# EAGLE design MYC_Homematic (EAGLE 7.3.0)
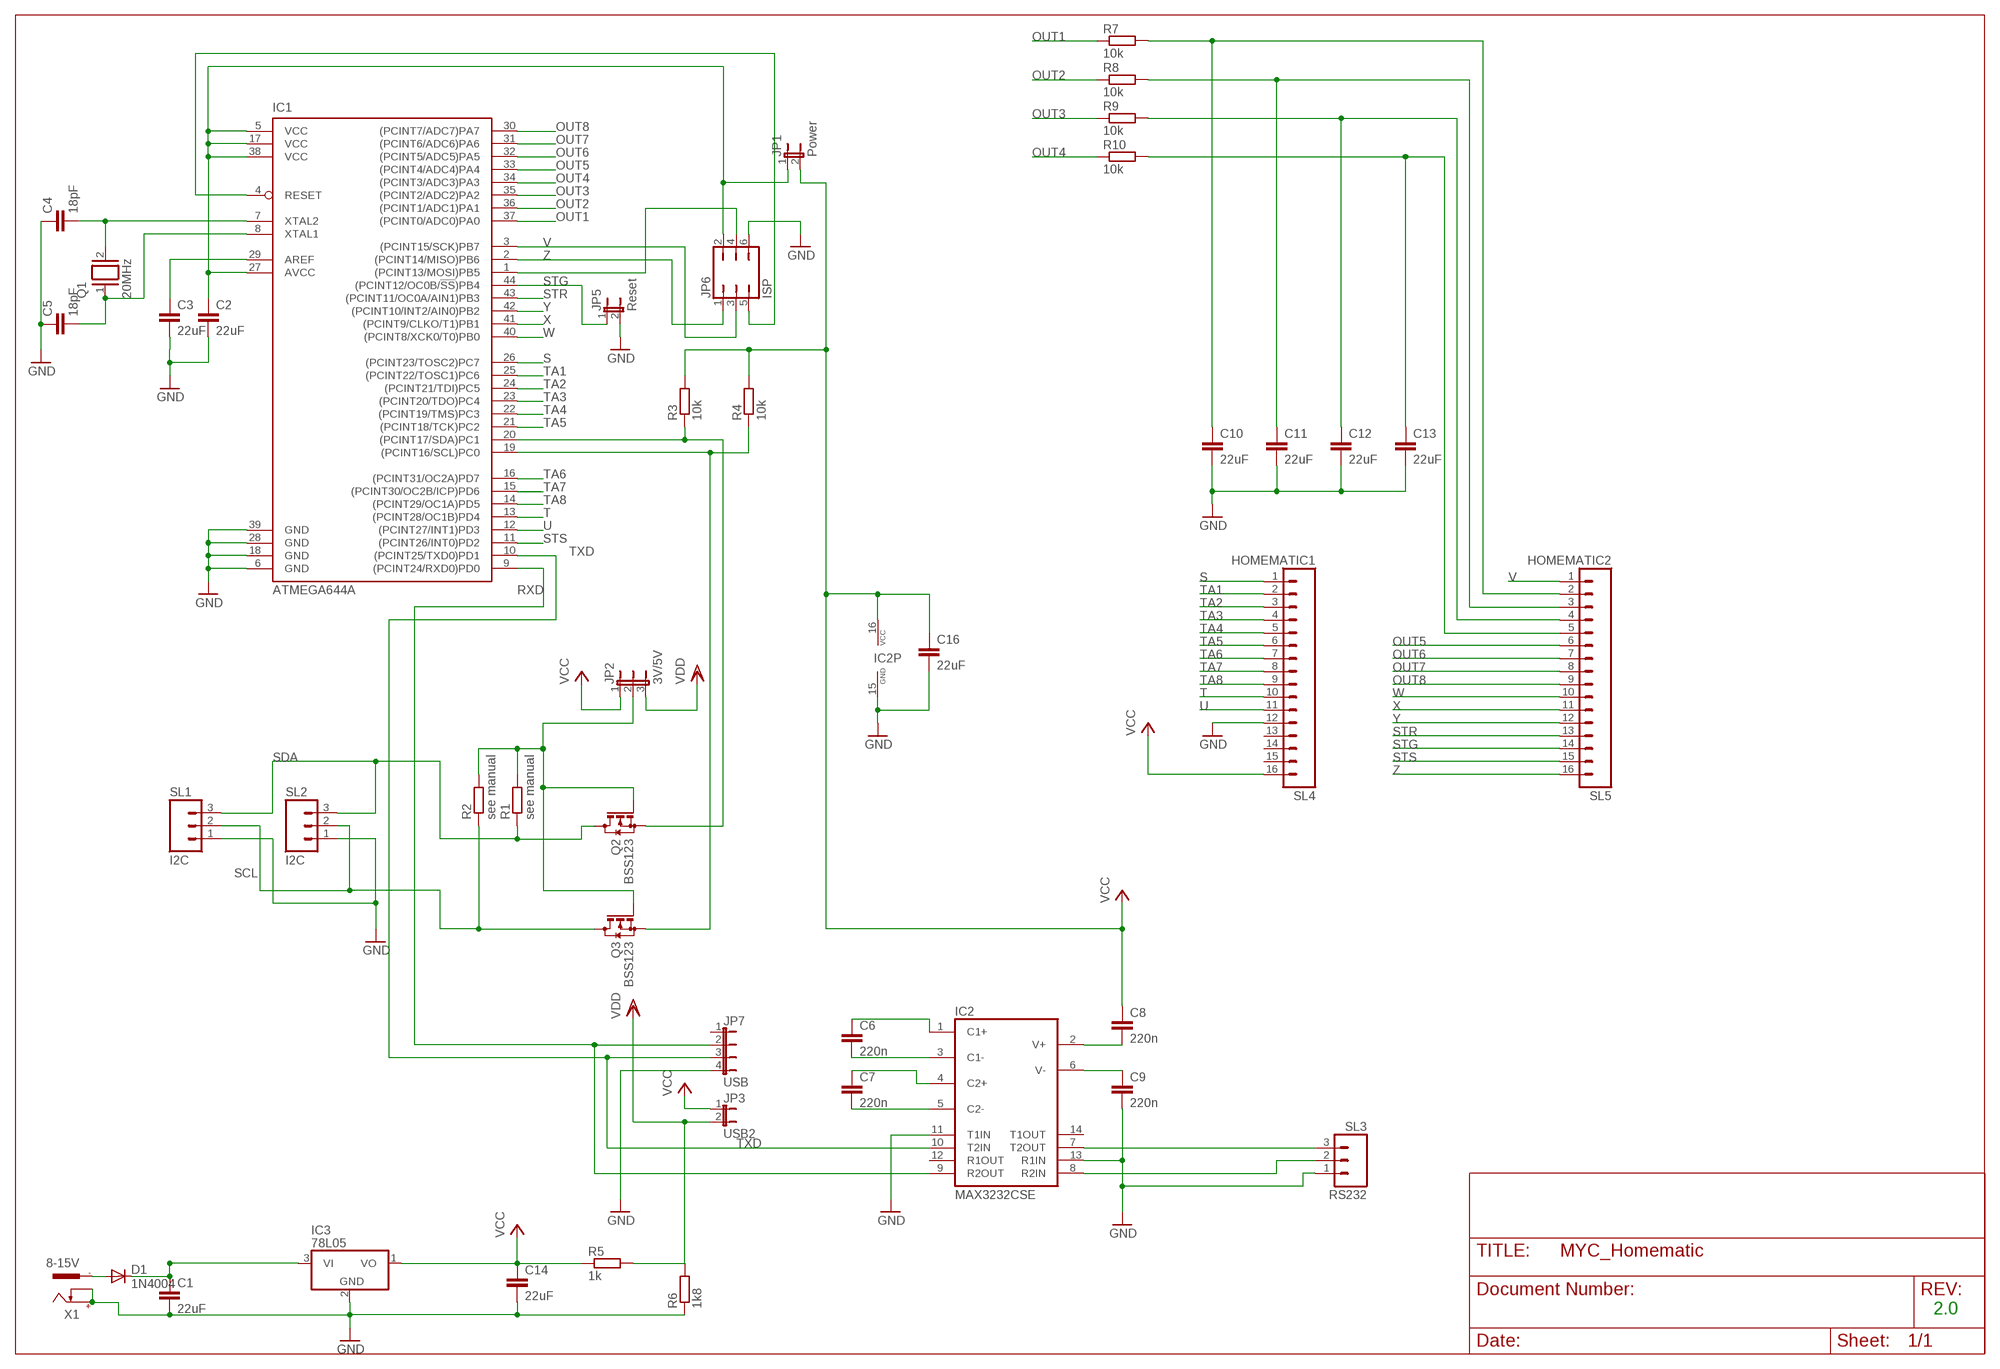
[diagram p0: schematic, sheet 1]

## Parts
C1  22uF  C-EUC1206  [C1206]
C2  22uF  C-EUC1206  [C1206]
C3  22uF  C-EUC1206  [C1206]
C4  18pF  C-EU025-030X050  [C025-030X050]
C5  18pF  C-EU025-030X050  [C025-030X050]
C6  220n  C-EUC1206  [C1206]
C7  220n  C-EUC1206  [C1206]
C8  220n  C-EUC1206  [C1206]
C9  220n  C-EUC1206  [C1206]
C10  22uF  C-EUC1206  [C1206]
C11  22uF  C-EUC1206  [C1206]
C12  22uF  C-EUC1206  [C1206]
C13  22uF  C-EUC1206  [C1206]
C14  22uF  C-EUC1206  [C1206]
C16  22uF  C-EUC1206  [C1206]
D1  1N4004  [DO41-10]
IC1  ATMEGA644A  [TQFP44]
IC2  MAX3232CSE  [SO16]
IC3  78L05  7805L  [TO92]
JP1  Power  JP1E  [JP1]
JP2  3V/5V  JP2E  [JP2]
JP3  USB2  JP1E  [JP1]
JP5  Reset  JP1E  [JP1]
JP6  ISP  JP3Q  [JP3Q]
JP7  USB  JP4E  [JP4]
Q1  20MHz  XTAL/S  [QS]
Q2  BSS123  [SOT23]
Q3  BSS123  [SOT23]
R1  see manual  R-EU_R1206  [R1206]
R2  see manual  R-EU_R1206  [R1206]
R3  10k  R-EU_R1206  [R1206]
R4  10k  R-EU_R1206  [R1206]
R5  1k  R-EU_R1206  [R1206]
R6  1k8  R-EU_R1206  [R1206]
R7  10k  R-EU_R1206  [R1206]
R8  10k  R-EU_R1206  [R1206]
R9  10k  R-EU_R1206  [R1206]
R10  10k  R-EU_R1206  [R1206]
SL1  I2C  M03  [03P]
SL2  I2C  M03  [03P]
SL3  RS232  M03  [03P]
SL4  HOMEMATIC1  M16  [16P]
SL5  HOMEMATIC2  M16  [16P]
X1  8-15V  737992-55  [737992-5]

## Nets
C13: C6.1 IC2.1(C1+)
GND: C1.2 C2.2 C3.2 C4.1 C5.1 C9.2 C10.2 C11.2 C12.2 C13.2 C14.2 C16.2 IC1.6(GND) IC1.18(GND) IC1.28(GND) IC1.39(GND) IC2.11(T1IN) IC2.13(R1IN) IC2.15(GND) IC3.2(GND) JP5.2 JP6.6 JP7.4 R6.1 SL1.1 SL2.1 SL3.1 SL4.12 X1.+ X1.K
N$1: C1.1 D1.C IC3.3(VI)
N$3: C7.2 IC2.5(C2-)
N$4: JP2.2 Q2.1(G) Q3.1(G) R1.2 R2.2
N$5: IC1.19((PCINT16/SCL)PC0) Q3.2(S) R4.1
N$6: C3.1 IC1.29(AREF)
N$7: C2.1 IC1.5(VCC) IC1.17(VCC) IC1.27(AVCC) IC1.38(VCC) JP1.1 JP6.2
N$8: IC1.20((PCINT17/SDA)PC1) Q2.2(S) R3.1
N$10: D1.A X1.-1
N$11: IC2.8(R2IN) SL3.2
N$12: IC1.1((PCINT13/MOSI)PB5) JP6.4
N$13: C7.1 IC2.4(C2+)
N$14: C6.2 IC2.3(C1-)
N$15: C10.1 R7.2 SL5.2
N$16: C8.2 IC2.2(V+)
N$17: C9.1 IC2.6(V-)
N$19: C4.2 IC1.7(XTAL2) Q1.2
N$20: C11.1 R8.2 SL5.3
N$21: C12.1 R9.2 SL5.4
N$22: C13.1 R10.2 SL5.5
N$24: IC1.4(RESET) JP6.5
N$27: IC2.7(T2OUT) SL3.3
N$37: C5.2 IC1.8(XTAL1) Q1.1
OUT1: IC1.37((PCINT0/ADC0)PA0) R7.1
OUT2: IC1.36((PCINT1/ADC1)PA1) R8.1
OUT3: IC1.35((PCINT2/ADC2)PA2) R9.1
OUT4: IC1.34((PCINT3/ADC3)PA3) R10.1
OUT5: IC1.33((PCINT4/ADC4)PA4) SL5.6
OUT6: IC1.32((PCINT5/ADC5)PA5) SL5.7
OUT7: IC1.31((PCINT6/ADC6)PA6) SL5.8
OUT8: IC1.30((PCINT7/ADC7)PA7) SL5.9
RXD: IC1.9((PCINT24/RXD0)PD0) IC2.9(R2OUT) JP7.2
S: IC1.26((PCINT23/TOSC2)PC7) SL4.1
SCL: Q3.3(D) R2.1 SL1.2 SL2.2
SDA: Q2.3(D) R1.1 SL1.3 SL2.3
STG: IC1.44((PCINT12/OC0B/!SS!)PB4) JP5.1 SL5.14
STR: IC1.43((PCINT11/OC0A/AIN1)PB3) SL5.13
STS: IC1.11((PCINT26/INT0)PD2) SL5.15
T: IC1.13((PCINT28/OC1B)PD4) SL4.10
TA1: IC1.25((PCINT22/TOSC1)PC6) SL4.2
TA2: IC1.24((PCINT21/TDI)PC5) SL4.3
TA3: IC1.23((PCINT20/TDO)PC4) SL4.4
TA4: IC1.22((PCINT19/TMS)PC3) SL4.5
TA5: IC1.21((PCINT18/TCK)PC2) SL4.6
TA6: IC1.16((PCINT31/OC2A)PD7) SL4.7
TA7: IC1.15((PCINT30/OC2B/ICP)PD6) SL4.8
TA8: IC1.14((PCINT29/OC1A)PD5) SL4.9
TXD: IC1.10((PCINT25/TXD0)PD1) IC2.10(T2IN) JP7.3
U: IC1.12((PCINT27/INT1)PD3) SL4.11
V: IC1.3((PCINT15/SCK)PB7) JP6.3 SL5.1
VCC: C8.1 C14.1 C16.1 IC2.16(VCC) IC3.1(VO) JP1.2 JP2.1 JP3.1 R3.2 R4.2 R5.1 SL4.16
VDD: JP2.3 JP3.2 R5.2 R6.2
W: IC1.40((PCINT8/XCK0/T0)PB0) SL5.10
X: IC1.41((PCINT9/CLKO/T1)PB1) SL5.11
Y: IC1.42((PCINT10/INT2/AIN0)PB2) SL5.12
Z: IC1.2((PCINT14/MISO)PB6) JP6.1 SL5.16
Unconnected: IC2.12(R1OUT) IC2.14(T1OUT) JP7.1 SL4.13 SL4.14 SL4.15 X1.-2

## Notes on the sheet
- 2.0

## Library data of the parts
C1-C14 C16 = resistor:C-EU: CAPACITOR, European symbol
D1 = diode:1N4004: DIODE general purpose rectifier, 1 A
IC1 = atmel:ATMEGA644: 8-bit Microcontroller with 64K Bytes In-System Programmable Flash Source: http://www.atmel.com/dyn/resources/prod_documents/doc2593.pdf; MPN: ATMEGA644PV-10AU; OC_FARNELL: 1455123; OC_NEWARK: 58M3748
IC2 = maxim:MAX3232*: True RS-232 Transceivers 3.0V to 5.5V, Low-Power up to 1Mbps, Using Four 0.1µF External Capacitors Source: http://pdfserv.maxim-ic.com/en/ds/MAX3222-MAX3241.pdf; MPN: MAX3232CSE; OC_FARNELL: 9725490; OC_NEWARK: 90C2890
IC3 = linear:78*: Positive VOLTAGE REGULATOR Source: http://cache.national.com/ds/LM/LM78L05.pdf http://www.fairchildsemi.com/ds/LM/LM7805.pdf
JP1 JP3 JP5 = jumper:JP1E: JUMPER
JP2 = jumper:JP2E: JUMPER
JP6 = jumper:JP3Q: JUMPER
JP7 = jumper:JP4E: JUMPER
Q1 = special:XTAL/S: CRYSTAL
Q2 Q3 = transistor-small-signal:BSS123: N-CHANNEL MOS FET
R1-R10 = resistor:R-EU_: RESISTOR, European symbol
SL1-SL3 = con-amp-quick:M03: AMP QUICK CONNECTOR; OC_FARNELL: unknown; OC_NEWARK: unknown
SL4 SL5 = con-amp-quick:M16: AMP QUICK CONNECTOR; OC_FARNELL: unknown; OC_NEWARK: unknown
X1 = con-conrad:737992-55: FEMALE PRINT CONNECTOR DIN 45323 (34V/3A), ROKA, distributor Conrad

## Board
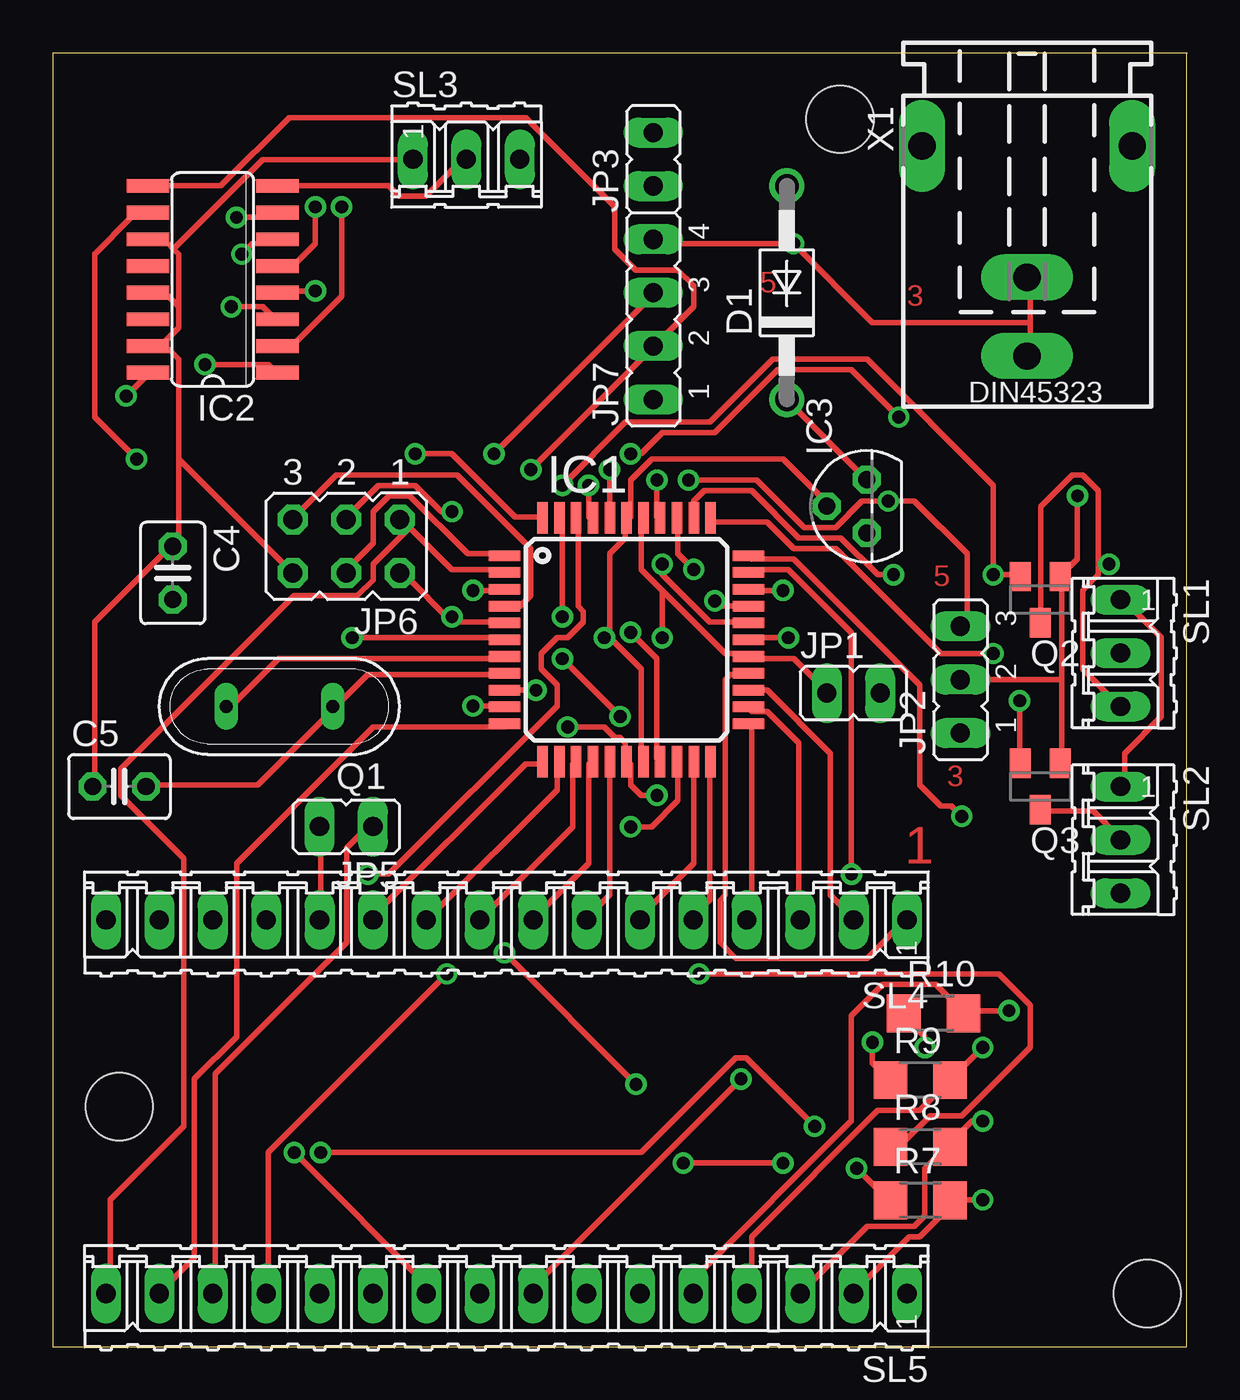
[diagram p1: board, top side]
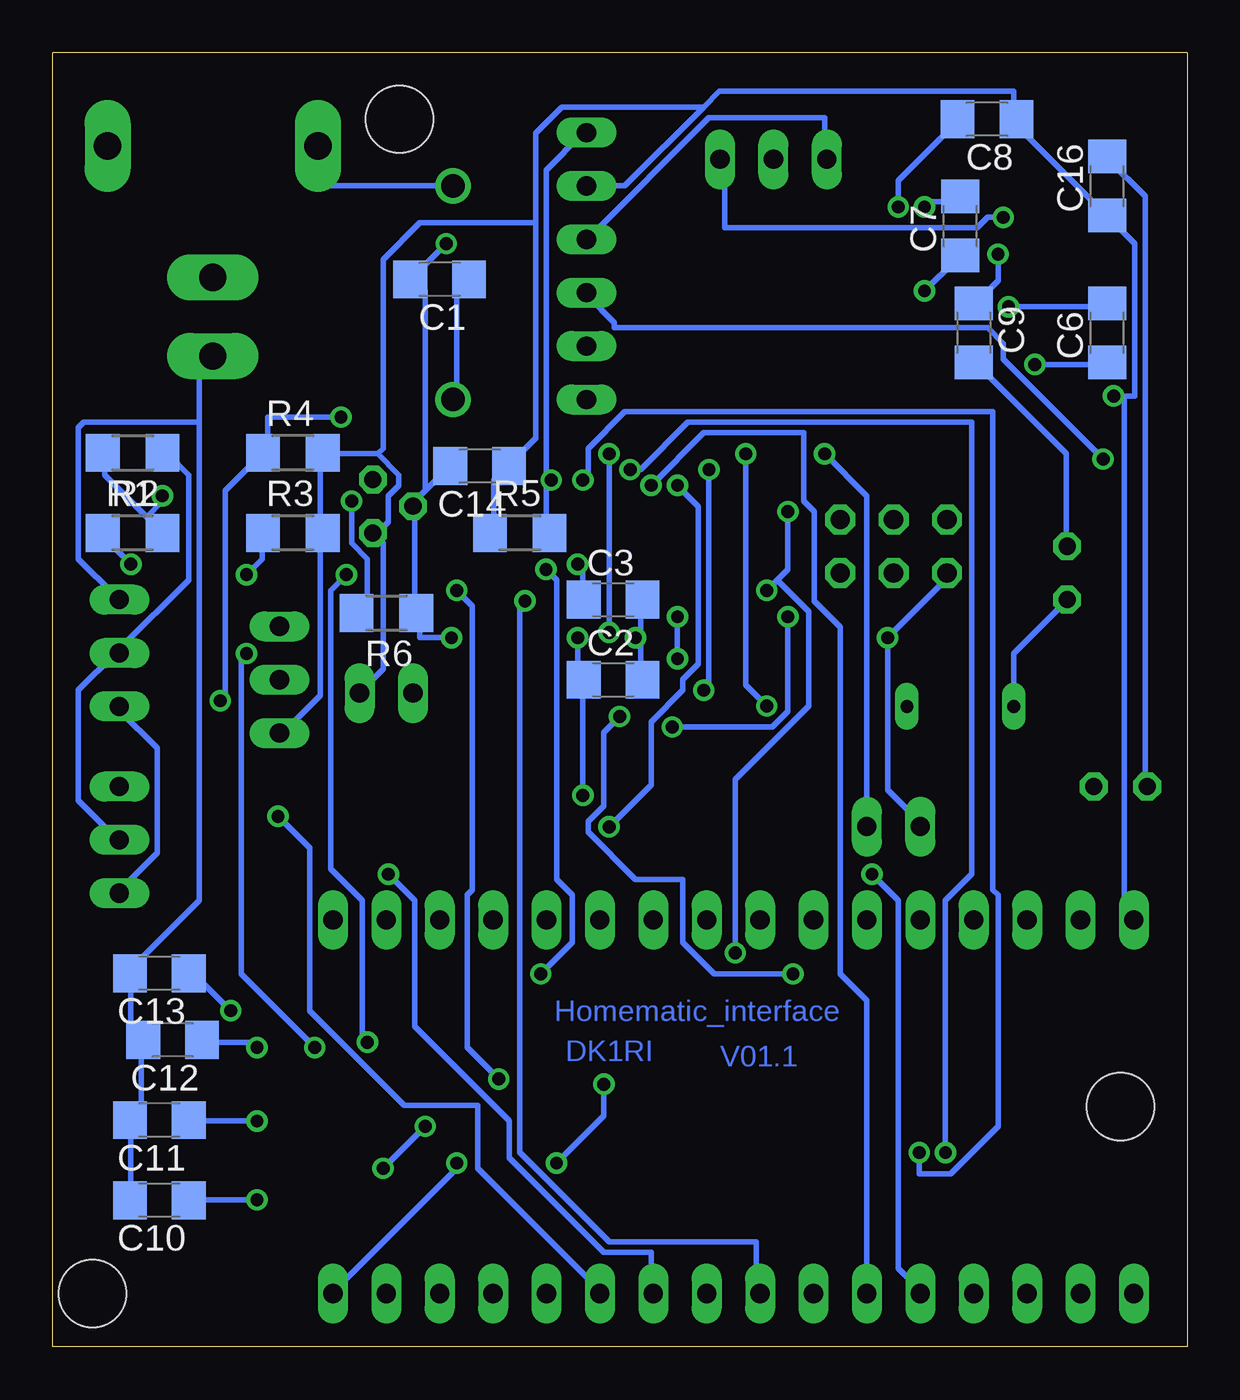
[diagram p2: board, bottom side, seen from below]

Size 53.98 x 61.59 mm. Coordinates in mm from the lower left corner, seen from the top.
Outline: 53.95,61.58 53.95,0 0,0 0,61.59 53.98,61.59
Copper layers (1*16): Top 0.035mm / dielectric 1.5mm / Bottom 0.035mm
Design rules "default": minimum track width 10mil, minimum drill 24mil, track to track 8mil, track to pad 8mil, pad to pad 8mil, via to via 8mil, smd to smd 8mil, copper to edge 40mil, drill to drill 8mil, minimum pad ring 10mil, minimum via ring 8mil, stop-mask expansion 4mil, vias tented up to drill 0mil, thermal gap 10mil
Holes 3.2 mm at 37.47,58.42 52.07,2.54 3.17,11.43

### Footprints (pad centres in the part's own frame; a part is rotated, then mirrored left to right if it is on the bottom)
C1206 = smd 1.6 x 1.8: 1 -1.4,0; 2 1.4,0
C025-030X050 = drill 0.813 octagon: 1 -1.27,0; 2 1.27,0
DO41-10 = drill 1.118: A 5.08,0; C -5.08,0
TQFP44 = smd 1.5 x 0.5: 1 -5.8,4; 2 -5.8,3.2; 3 -5.8,2.4; 4 -5.8,1.6; 5 -5.8,0.8; 6 -5.8,0; 7 -5.8,-0.8; 8 -5.8,-1.6; 9 -5.8,-2.4; 10 -5.8,-3.2; 11 -5.8,-4; 23 5.8,-4; 24 5.8,-3.2; 25 5.8,-2.4; 26 5.8,-1.6; 27 5.8,-0.8; 28 5.8,0; 29 5.8,0.8; 30 5.8,1.6; 31 5.8,2.4; 32 5.8,3.2; 33 5.8,4 | smd 0.5 x 1.5: 12 -4,-5.8; 13 -3.2,-5.8; 14 -2.4,-5.8; 15 -1.6,-5.8; 16 -0.8,-5.8; 17 0,-5.8; 18 0.8,-5.8; 19 1.6,-5.8; 20 2.4,-5.8; 21 3.2,-5.8; 22 4,-5.8; 34 4,5.8; 35 3.2,5.8; 36 2.4,5.8; 37 1.6,5.8; 38 0.8,5.8; 39 0,5.8; 40 -0.8,5.8; 41 -1.6,5.8; 42 -2.4,5.8; 43 -3.2,5.8; 44 -4,5.8
SO16 = smd 0.66 x 2.032: 1 -4.445,-3.073; 2 -3.175,-3.073; 3 -1.905,-3.073; 4 -0.635,-3.073; 5 0.635,-3.073; 6 1.905,-3.073; 7 3.175,-3.073; 8 4.445,-3.073; 9 4.445,3.073; 10 3.175,3.073; 11 1.905,3.073; 12 0.635,3.073; 13 -0.635,3.073; 14 -1.905,3.073; 15 -3.175,3.073; 16 -4.445,3.073
TO92 = drill 0.813 octagon: 1 -1.27,0; 2 0,1.905; 3 1.27,0
JP1 = drill 0.914 long: 1 0,-1.27; 2 0,1.27
JP2 = drill 0.914 long: 1 -2.54,0; 2 0,0; 3 2.54,0
JP3Q = drill 0.914 octagon: 1 -2.54,-1.27; 2 -2.54,1.27; 3 0,-1.27; 4 0,1.27; 5 2.54,-1.27; 6 2.54,1.27
JP4 = drill 0.914 long: 1 -3.81,0; 2 -1.27,0; 3 1.27,0; 4 3.81,0
QS = drill 0.61 long: 1 -2.54,0; 2 2.54,0
SOT23 = smd 1 x 1.4: 1 -0.95,-1.1; 2 0.95,-1.1; 3 0,1.1
R1206 = smd 1.6 x 1.803: 1 -1.422,0; 2 1.422,0
03P = drill 0.914 long: 1 -2.54,0; 2 0,0; 3 2.54,0
16P = drill 0.914 long: 1 -19.05,0; 2 -16.51,0; 3 -13.97,0; 4 -11.43,0; 5 -8.89,0; 6 -6.35,0; 7 -3.81,0; 8 -1.27,0; 9 1.27,0; 10 3.81,0; 11 6.35,0; 12 8.89,0; 13 11.43,0; 14 13.97,0; 15 16.51,0; 16 19.05,0
737992-5 = drill 1.3 pad 2.184 long: + 0,10; -1 5,0; -2 -5,0; K 0,6.25

### Placement (x,y rotation side)
C1  35.56,50.8 180 bottom
C2  27.3,31.75 0 bottom
C3  27.3,35.56 0 bottom
C4  5.71,36.83 270 top
C5  3.17,26.67 0 top
C6  3.81,48.26 90 bottom
C7  10.79,53.34 90 bottom
C8  9.53,58.42 180 bottom
C9  10.16,48.26 270 bottom
C10  48.9,6.99 180 bottom
C11  48.9,10.79 180 bottom
C12  48.26,14.61 180 bottom
C13  48.9,17.78 180 bottom
C14  33.66,41.91 180 bottom
C16  3.81,55.24 90 bottom
D1  34.92,50.16 90 top
IC1  27.3,33.66 0 top
IC2  7.62,50.8 90 top
IC3  38.73,40.01 90 top
JP1  38.1,31.11 270 top
JP2  43.18,31.75 90 top
JP3  28.57,56.52 0 top
JP5  13.97,24.77 90 top
JP6  13.97,38.1 180 top
JP7  28.57,48.9 90 top
Q1  10.79,30.48 180 top
Q2  46.99,35.56 180 top
Q3  46.99,26.67 180 top
R1  50.16,38.73 0 bottom
R2  50.16,42.55 180 bottom
R3  42.55,38.73 0 bottom
R4  42.55,42.55 0 bottom
R5  31.75,38.73 0 bottom
R6  38.1,34.92 180 bottom
R7  41.27,6.99 0 top
R8  41.27,9.53 0 top
R9  41.27,12.7 0 top
R10  41.91,15.88 0 top
SL1  50.8,33.02 270 top
SL2  50.8,24.13 270 top
SL3  19.68,56.52 0 top
SL4  21.59,20.32 180 top
SL5  21.59,2.54 180 top
X1  46.35,57.15 180 top

### Tracks (layer width: path | path; a pad name or v marks a point on that pad's centre or on a via)
C13  (via drill 0.61)
  Top 0.254: v7.25,46.75 10.25,46.75 10.5,46.5 IC2.1
  Bottom 0.254: v7.25,46.75 4,46.75 C6.1
GND  (via drill 0.61)
  Top 0.254: SL2.1 51,26.75 51,28.25 52.75,30 52.75,33.75 51,35.5 SL1.1 | 46.5,48.75 46.5,50.75 X1.K | 46.5,48.75 46.5,47.25 X1.+ | 26.5,33.75 28,32.25 28,28 IC1.18 | 26.5,33.75 26.5,37.75 27.25,38.5 27.25,39.25 IC1.39 27.5,39.5 27.5,41.25 28.5,42.25 34.75,42.25 36.75,40.25 IC3.2 | 26.5,33.75 v26.25,33.75 | v35,33.75 33.25,33.75 IC1.28 | SL4.12 12.75,20.5 12.75,24.75 JP5.2 | v14.25,33.75 21.5,33.75 IC1.6 | 5.25,47.75 4.75,47.75 IC2.15 5.25,47.75 | 5.25,47.75 6,48.5 6,49.5 | 6,49.5 5.5,50 4.75,50 IC2.13 | 5.75,52.25 6,52 6,49.5 | 5.75,52.25 5.5,52.5 4.75,52.5 IC2.11 | 5.25,47.75 6,47 6,42.25 | 6,42.25 6,38.5 5.75,38.25 C4.1 5.5,38 2,34.5 2,26.75 C5.1 | 5.75,52.25 10,56.5 17,56.5 SL3.1 | 6,42.25 11.25,37 JP6.6 | JP7.4 28.75,52.5 v35.25,52.5 39,48.75 46.5,48.75
  Bottom 0.254: C10.2 50.25,7 50.25,10.75 C11.2 50.25,11 49.75,11.5 49.75,14.5 C12.2 49.75,14.75 50.25,15.25 50.25,17.75 C13.2 50.25,18 47,21.25 47,44 | 47,44 47,46.5 46.5,47 X1.+ | 47,44 52.5,44 52.75,43.75 52.75,37.5 51,35.75 SL1.1 | 26,33.75 26,35.5 C3.2 | 26,33.75 26,31.75 C2.2 | v26.25,33.75 26,33.75 | v35,33.75 36.5,33.75 36.5,34.75 R6.1 36.75,35 36.75,40 IC3.2 36.75,40.25 36.25,40.75 | 36.25,40.75 35.25,41.75 C14.2 | 36.25,40.75 36.25,50.25 36.75,50.75 C1.2 36.75,51 v35.25,52.5 | C16.2 3.75,56.5 2,54.75 2,26.75 C5.1 | JP6.6 11.5,36.75 11.5,36.5 v14.25,33.75 14.25,26.5 12.75,25 JP5.2 | JP7.4 28.5,52.75 22.75,58.5 17.25,58.5 17.25,56.75 SL3.1 | C9.2 10,46.75 5.75,42.5 5.75,38.25 C4.1
N$1
  Top 0.254: IC3.3 38.5,41.5 35,45 D1.C
  Bottom 0.254: C1.1 34.25,50.75 34.75,50.25 34.75,45.25 D1.C
N$3  (via drill 0.61)
  Top 0.254: v12.5,54.25 12.5,52.5 11.5,51.5 10.75,51.5 IC2.5
  Bottom 0.254: v12.5,54.25 12.5,54.5 11,54.5 C7.2
N$4  (via drill 0.61)
  Top 0.254: 48,31.75 48,36.5 Q2.1 48,36.75 48.75,37.5 v48.75,40.5 | 48,31.75 48,28 Q3.1 | 48,31.75 JP2.2
  Bottom 0.254: 49.5,39.5 51.5,41.5 51.5,42.5 R2.2 | 49.5,39.5 48.75,38.75 R1.2 49.5,39.5 | 49.5,39.5 48.75,40.25 v48.75,40.5
N$5  (via drill 0.61)
  Top 0.254: v46,30.75 46,28 Q3.2 | v27.5,34 28.75,32.75 28.75,28 IC1.19 | v27.5,42.5 28,42.5 29,43.5 31.5,43.5 34.5,46.5 38,46.5 v40.25,44.25
  Bottom 0.254: v46,30.75 45.75,31 45.75,40.75 44,42.5 R4.1 43.75,42.75 43.75,44.25 v40.25,44.25 | v27.5,42.5 v27.5,34
N$6  (via drill 0.61)
  Top 0.254: v29,37.25 29,36.75 31.25,34.5 33,34.5 IC1.29
  Bottom 0.254: v29,37.25 28.75,37 28.75,35.75 C3.1
N$7  (via drill 0.61)
  Top 0.254: 19,34.5 21.5,34.5 IC1.5 | 19,34.5 16.75,36.75 JP6.2 | v28.75,26.25 28,26.25 27.5,26.75 27.5,27.75 IC1.17 27.25,28 27.25,28.75 27,29 26.75,29 26.25,29.5 v24.5,29.5 | JP1.1 36.75,31.25 35.25,32.75 33.25,32.75 IC1.27 33,33 32,33 29,36 | 29,36 28,37 28,39.25 IC1.38 | 29,36 v29,33.75 | v19,34.75 19,34.5
  Bottom 0.254: 28.75,31.75 v28.75,26.25 | 28.75,31.75 29,32 v29,33.75 | 28.75,31.75 C2.1 | v19,34.75 19,30.25 19.75,29.5 v24.5,29.5
N$8  (via drill 0.61)
  Top 0.254: Q2.2 46,36.75 v44.75,36.75 44.75,41 38.75,47 34.25,47 31.25,44 27.25,44 v24.25,41 | v27.5,24.75 28.5,24.75 29.75,26 29.75,27.75 IC1.20
  Bottom 0.254: v44.75,36.75 44,37.5 44,38.5 R3.1 | v27.5,24.75 25.5,26.75 25.5,29.75 24,31.25 24,31.75 23.25,32.5 23.25,40 v24.25,41
N$10
  Bottom 0.254: D1.A 35,55.25 41.25,55.25 41.25,57 X1.-1
N$11
  Top 0.254: IC2.8 10.75,55.25 16,55.25 16.5,54.75 17.75,54.75 19.5,56.5 SL3.2
N$12
  Top 0.254: IC1.1 21.5,37.75 19.75,37.75 17,40.5 16,40.5 15.25,39.75 15.25,38.25 14,37 JP6.4
N$13  (via drill 0.61)
  Top 0.254: v12.5,50.25 10.75,50.25 IC2.4
  Bottom 0.254: v12.5,50.25 11,51.75 C7.1
N$14  (via drill 0.61)
  Top 0.254: v8.5,49.5 10,49.5 10.5,49 IC2.3
  Bottom 0.254: v8.5,49.5 4,49.5 C6.2
N$15  (via drill 0.61)
  Top 0.254: v44.25,7 42.75,7 R7.2 42.75,6.75 41.25,5.25 40.75,5.25 38.25,2.75 SL5.2
  Bottom 0.254: v44.25,7 47.25,7 C10.1
N$16  (via drill 0.61)
  Top 0.254: v13.75,54.25 13.75,50 11.5,47.75 10.75,47.75 IC2.2
  Bottom 0.254: v13.75,54.25 13.75,55.5 11,58.25 C8.2
N$17  (via drill 0.61)
  Top 0.254: v9,52 9.5,52.5 10.5,52.5 IC2.6
  Bottom 0.254: v9,52 9,50.75 10,49.75 C9.1
N$19
  Top 0.254: IC1.7 21.5,32.75 10.75,32.75 8.5,30.5 Q1.2
  Bottom 0.254: C4.2 5.75,35.5 8.25,33 8.25,30.5 Q1.2
N$20  (via drill 0.61)
  Top 0.254: v44.25,10.75 43.75,10.75 42.75,9.75 R8.2 42.5,9.5 41.5,8.5 41.5,6.25 41,5.75 38.75,5.75 35.75,2.75 SL5.3
  Bottom 0.254: v44.25,10.75 47.25,10.75 C11.1
N$21  (via drill 0.61)
  Top 0.254: v44.25,14.25 42.75,12.75 R9.2 42.5,12.5 41.25,11.25 39.25,11.25 33.25,5.25 33.25,2.75 SL5.4
  Bottom 0.254: v44.25,14.25 44.25,14.5 46.75,14.5 C12.1
N$22  (via drill 0.61)
  Top 0.254: v45.5,16 43.5,16 R10.2 43.25,16 42,17.25 39.5,17.25 38,15.75 38,10.75 30.5,3.25 30.5,2.75 SL5.5
  Bottom 0.254: v45.5,16 47.25,17.75 C13.1
N$24
  Top 0.254: IC1.4 21.75,35.25 22.25,35.25 22.75,35.75 22.75,38 19.25,41.5 13.5,41.5 11.5,39.5 JP6.5
N$27  (via drill 0.61)
  Top 0.254: v8.75,53.75 10.5,53.75 IC2.7
  Bottom 0.254: v8.75,53.75 9.5,53.75 10,53.25 22,53.25 22,56.5 SL3.3
N$37
  Top 0.254: IC1.8 21.5,32 15,32 13.5,30.5 Q1.1 13.25,30.25 9.75,26.75 4.5,26.75 C5.2
OUT1  (via drill 0.61)
  Top 0.254: v28.75,41.25 28.75,39.5 IC1.37 | v12.75,9.25 28,9.25 32.5,13.75 33,13.75 v36.25,10.5 | v38.25,8.5 39.75,7 R7.1
  Bottom 0.254: v28.75,41.25 28.5,41.5 28.5,42.75 26.75,44.5 9.25,44.5 9.25,21.75 9,21.5 9,10.5 11.25,8.25 12.75,8.25 v12.75,9.25 | v38.25,8.5 v36.25,10.5
OUT2  (via drill 0.61)
  Top 0.254: v30.5,37 29.75,37.75 29.75,39.25 IC1.36 | v30.75,17.75 45,17.75 46.5,16.25 46.5,14.25 43.25,11 41.75,11 40.5,9.75 40,9.75 R8.1
  Bottom 0.254: v30.5,37 30,36.5 30,22.25 29.25,21.5 29.25,19.25 v30.75,17.75
OUT3  (via drill 0.61)
  Top 0.254: v40,36.75 39.25,36.75 37.5,38.5 35.5,38.5 33.25,40.75 31,40.75 30.5,40.25 30.5,39.5 IC1.35 | v39,14.5 39,13.5 39.75,12.75 R9.1
  Bottom 0.254: v40,36.75 40.75,36 40.75,22.75 39.25,21.25 39.25,14.75 v39,14.5
OUT4  (via drill 0.61)
  Top 0.254: v44.75,33 42.25,33 37.25,38 35.25,38 34,39.25 31.5,39.25 IC1.34 | v41.5,14.25 41.5,14.75 40.5,15.75 R10.1
  Bottom 0.254: v44.75,33 45,32.75 45,17.75 v41.5,14.25
OUT5  (via drill 0.61)
  Top 0.254: v43.25,25.25 42.75,25.75 42.25,25.75 41.25,26.75 41.25,31.5 35.25,37.5 33.25,37.5 IC1.33
  Bottom 0.254: v43.25,25.25 41.75,23.75 41.75,16 37.25,11.5 33.75,11.5 33.75,8.5 28,2.75 SL5.6
OUT6  (via drill 0.61)
  Top 0.254: v38,22.5 38,34 35,37 33.25,37 IC1.32
  Bottom 0.254: v38,22.5 36.75,21.25 36.75,15.25 32.25,10.75 32.25,9 27.75,4.5 25.5,4.5 25.5,2.75 SL5.7
OUT7  (via drill 0.61)
  Top 0.254: v34.75,36 33.25,36 IC1.31 | v32.75,12.75 22.75,2.75 SL5.8
  Bottom 0.254: v34.75,36 34,35.25 34,21.75 34.25,21.5 34.25,14.25 v32.75,12.75
OUT8  (via drill 0.61)
  Top 0.254: v31.5,35.5 31.75,35.25 33,35.25 IC1.30
  Bottom 0.254: v31.5,35.5 31.75,35.25 31.75,9.25 27.5,5 20.5,5 20.5,2.75 SL5.9
RXD  (via drill 0.61)
  Top 0.254: v23,31.25 21.75,31.25 IC1.9 | v22.75,41.75 28.5,47.5 JP7.2 28.75,47.75 30.5,49.5 30.5,50.5 29.75,51.25 27.75,51.25 26.75,52.25 26.75,54.25 22.5,58.5 11.25,58.5 8,55.25 4.75,55.25 IC2.9
  Bottom 0.254: v23,31.25 22.75,31.5 v22.75,41.75
S
  Top 0.254: IC1.26 33,32 32.25,32 32,31.75 32,21.5 31.75,21.25 31.75,19.25 32.5,18.5 38.75,18.5 40.5,20.25 SL4.1
SCL
  Top 0.254: Q3.3 47,25.5 49.5,25.5 50.75,24.25 SL2.2
  Bottom 0.254: R2.1 48.5,42.5 47.5,41.5 47.5,36.5 50.75,33.25 SL1.2 51,33 52.75,31.25 52.75,26 51,24.25 SL2.2
SDA  (via drill 0.61)
  Top 0.254: 49.75,37.25 49.75,36.75 49,36 49,32.25 50.75,30.5 SL1.3 | 49.75,37.25 49.75,40.75 49,41.5 48.5,41.5 47,40 47,34.5 Q2.3 | 49.75,37.25 v50.25,37.25
  Bottom 0.254: v50.25,37.25 51.5,38.5 R1.1 | SL2.3 50.75,21.75 49,23.5 49,28.5 50.75,30.25 SL1.3
STG  (via drill 0.61)
  Top 0.254: v17.25,42.5 19,42.5 22,39.5 23.25,39.5 IC1.44 | SL5.14 7.75,2.75 7.75,13 14,19.25 14,23.75 15,24.75 JP5.1
  Bottom 0.254: v17.25,42.5 15.25,40.5 15.25,25 JP5.1
STR  (via drill 0.61)
  Top 0.254: v24.25,34.75 24.25,39.25 IC1.43 | v27,30 v24.25,32.75 | v18.75,17.75 10.25,9.25 10.25,2.75 SL5.13
  Bottom 0.254: v24.25,32.75 v24.25,34.75 | v27,30 27.75,29.25 27.75,25.75 28.5,25 28.5,24.5 26.25,22.25 24,22.25 24,19.25 22.5,17.75 v18.75,17.75
STS
  Top 0.254: IC1.11 21.5,29.5 15.25,29.5 8.75,23 8.75,14.75 6.75,12.75 6.75,4.25 5.25,2.75 SL5.15
T
  Top 0.254: IC1.13 24,27.75 24,26.5 18,20.5 SL4.10
TA1
  Top 0.254: IC1.25 33.25,31.25 34,31.25 37,28.25 37,21.5 38,20.5 SL4.2
TA2
  Top 0.254: IC1.24 33.25,30.25 34,30.25 35.5,28.75 35.5,20.5 SL4.3
TA3
  Top 0.254: IC1.23 33.25,29.5 33.25,20.5 SL4.4
TA4
  Top 0.254: IC1.22 31.25,27.75 31.25,21.25 30.5,20.5 SL4.5
TA5
  Top 0.254: IC1.21 30.5,27.75 30.5,23 28,20.5 SL4.6
TA6
  Top 0.254: IC1.16 26.5,27.75 26.5,21.5 25.5,20.5 SL4.7
TA7
  Top 0.254: IC1.15 25.5,27.75 25.5,23 23,20.5 SL4.8
TA8
  Top 0.254: SL4.9 24.75,24.75 24.75,27.75 IC1.14
TXD  (via drill 0.61)
  Top 0.254: v20,30.5 21.5,30.5 IC1.10 | v21,42.5 28.5,50 JP7.3 | v4,42.25 2,44.25 2,52 3.75,53.75 4.5,53.75 IC2.10
  Bottom 0.254: v20,30.5 21,31.5 v21,42.5 | v4,42.25 8.75,47 8.75,47.75 9.5,48.5 27.25,48.5 27.25,48.75 28.5,50 JP7.3
U
  Top 0.254: IC1.12 23.25,27.75 22.5,27.75 15.25,20.5 SL4.11
V  (via drill 0.61)
  Top 0.254: v20,36 21.5,36 IC1.3 | v19,39.75 18.5,39.75 17.25,41 15.5,41 14,39.5 JP6.3 | v30,8.75 v34.75,8.75 | v21.5,18.75 v27.75,12.5
  Bottom 0.254: 19.5,36.5 19,37 v19,39.75 | 19.5,36.5 v20,36 | v34.75,8.75 34.75,8.5 40.5,2.75 SL5.1 | v30,8.75 27.75,11 v27.75,12.5 | v21.5,18.75 21.5,27 18,30.5 18,35 19.5,36.5
VCC  (via drill 0.61)
  Top 0.254: v3.5,45.25 4.5,46.25 IC2.16
  Bottom 0.254: JP1.2 39.25,31.25 38.25,32.25 38.25,38.25 IC3.1 38.5,38.75 38,39.25 38,40.5 37.5,41 37.5,41.5 38.5,42.5 | JP2.1 43,29.25 41.25,31 41.25,38.5 R3.2 41.25,38.75 41.25,42.5 R4.2 41,42.5 38.5,42.5 | R5.1 33,38.75 33,41.25 32.5,41.75 C14.1 32.25,42 31,43.25 31,53.5 | 3,45.25 2.5,45.25 2.5,52.5 3.75,53.75 C16.1 4,54 8,58 8,58.25 C8.1 8.25,58.5 8.25,59.75 22.25,59.75 23,59 | 3,45.25 3,20.75 2.75,20.5 SL4.16 | 3,45.25 v3.5,45.25 | 23,59 26.75,55.25 28.5,55.25 JP3.1 | 31,53.5 31,57.75 29.75,59 23,59 | 38.5,42.5 38.25,42.75 38.25,51.75 36.5,53.5 31,53.5
VDD  (via drill 0.61)
  Top 0.254: JP2.3 43.25,34.5 43.5,34.75 43.5,37.75 41,40.25 v39.75,40.25 38.5,40.25 37.25,39 35.75,39 33.5,41.25 v30.25,41.25
  Bottom 0.254: v39.75,40.25 39.75,38.25 39,37.5 39,35.5 39.5,35 R6.2 | 30.5,41.25 30.5,56 28.75,57.75 JP3.2 | 30.5,41.25 30.5,38.75 R5.2 | 30.5,41.25 v30.25,41.25
W  (via drill 0.61)
  Top 0.254: v26.5,41.75 26.5,39.5 IC1.40 | v11.5,9.25 18,2.75 SL5.10
  Bottom 0.254: v26.5,41.75 26,41.75 23.75,44 10.25,44 10.25,22.5 11.5,21.25 v11.5,9.25
X  (via drill 0.61)
  Top 0.254: v25.5,41 25.5,39.5 IC1.41
  Bottom 0.254: v25.5,41 23,43.5 18.25,43.5 18.25,40.25 17.75,39.75 17.75,35.5 16.5,34.25 16.5,17.75 15.25,16.5 15.25,2.75 SL5.11
Y  (via drill 0.61)
  Top 0.254: v15,22.5 16,22.5 24,30.5 24,31.5 23.25,32.25 23.25,33 24,33.75 24.5,33.75 25.25,34.5 25.25,35 25,35.25 25,39.25 IC1.42
  Bottom 0.254: v15,22.5 13.75,21.25 13.75,3.75 12.75,2.75 SL5.12
Z
  Top 0.254: 17,39 16.75,39.25 JP6.1 17,39 | 17,39 19,37 21.5,37 IC1.2 | 17,39 15.25,37.25 15.25,36.5 14.5,35.75 11.5,35.75 3.25,27.5 3.25,26.25 6.25,23.25 6.25,10.5 2.75,7 2.75,2.75 SL5.16

### Text on the board
Top: 5 | 3 | 5 | 3 | 1
Bottom: Homematic_interface | DK1RI | V01.1